# Altium schematic sheet PA stage 1.SchDoc
size A; SheetNumber: 8; SheetTotal: 12
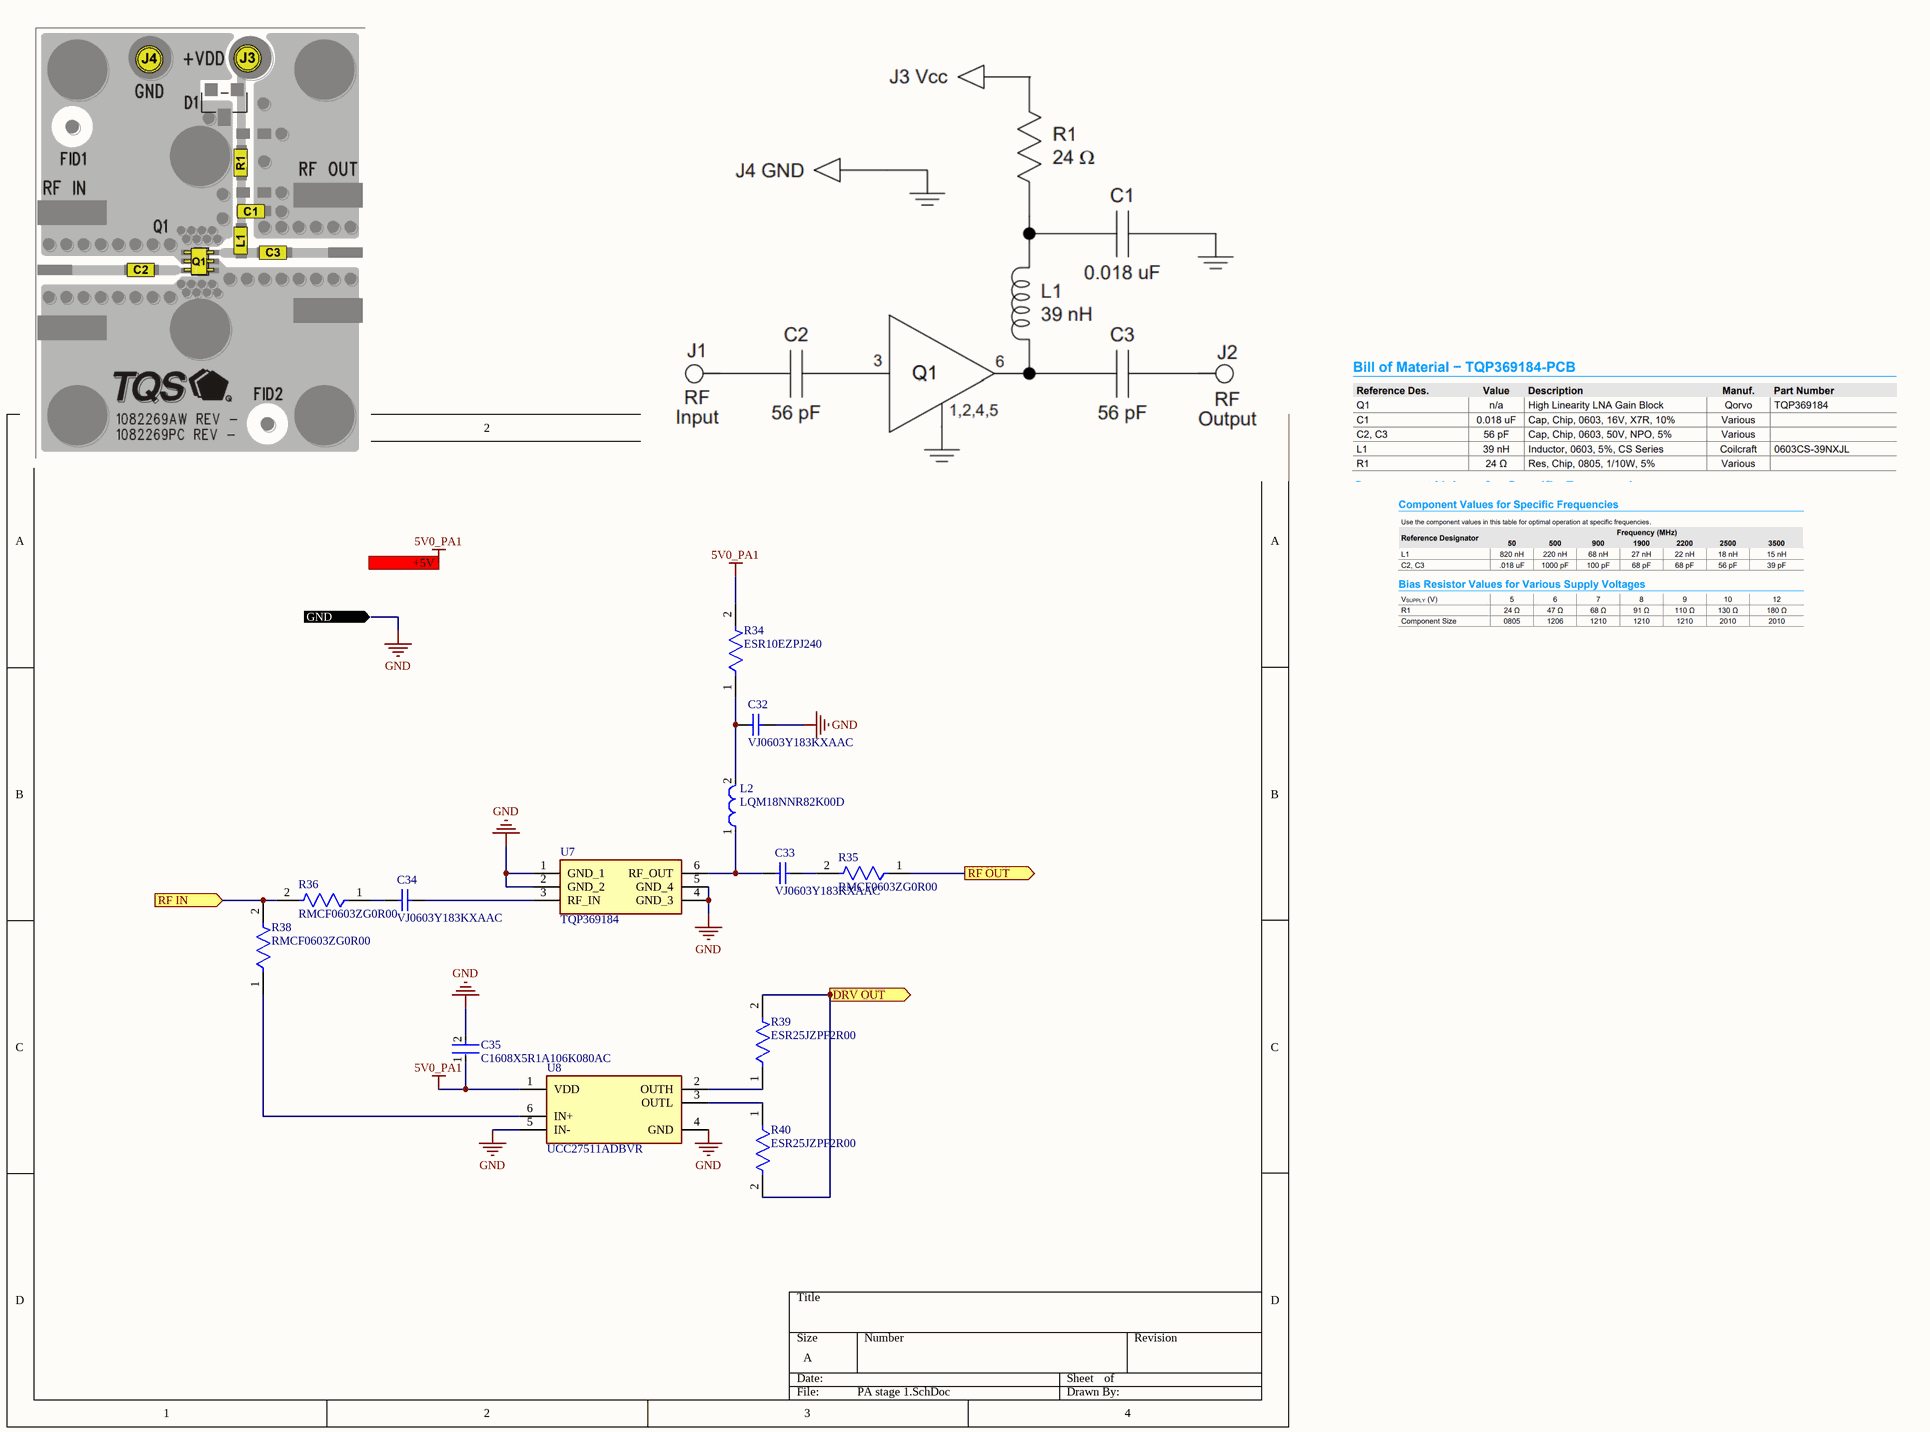
[diagram p0: PA stage 1.SchDoc]

## Parts
C32  VJ0603Y183KXAAC  [CAPC1608X92X38ML15T08]
C33  VJ0603Y183KXAAC  [CAPC1608X92X38ML15T08]
C34  VJ0603Y183KXAAC  [CAPC1608X92X38ML15T08]
C35  C1608X5R1A106K080AC  [FP-C1608-080-0_1-MFG]
L2  LQM18NNR82K00D  [FP-LQM18NN_00-IPC_B]
R34  ESR10EZPJ240  [FP-ESR10-IPC_C]
R35  RMCF0603ZG0R00  [FP-RMCF0603-IPC_B]
R36  RMCF0603ZG0R00  [FP-RMCF0603-IPC_B]
R38  RMCF0603ZG0R00  [FP-RMCF0603-IPC_B]
R39  ESR25JZPF2R00  [FP-ESR25-MFG]
R40  ESR25JZPF2R00  [FP-ESR25-MFG]
U7  TQP369184  [SOT65P210X110-6N]
U8  UCC27511ADBVR  [FP-DBV0006A-IPC_B]

## Ports
+5V (in), DRV OUT (out), GND (in), RF IN (in), RF OUT (out)

## Nets
5V0_PA1: C35.1 R34.2 U8.1(VDD) ; port +5V
GND: C32.2 C35.2 U7.1(GND_1) U7.2(GND_2) U7.4(GND_3) U7.5(GND_4) U8.4(GND) U8.5(IN-) ; port GND
DRV OUT: R39.2 R40.2 ; port DRV OUT
RF IN: R36.2 R38.2 ; port RF IN
RF OUT: R35.1 ; port RF OUT
NetC32_1: C32.1 L2.2 R34.1
NetC33_1: C33.1 L2.1 U7.6(RF_OUT)
NetC33_2: C33.2 R35.2
NetC34_1: C34.1 R36.1
NetC34_2: C34.2 U7.3(RF_IN)
NetR38_1: R38.1 U8.6(IN+)
NetR39_1: R39.1 U8.2(OUTH)
NetR40_1: R40.1 U8.3(OUTL)

## Library data of the parts
C32-C34 = CMP-2006-01326-1: Manufacturer: Vitramon; Part Number: VJ0603Y183KXAAC
C35 = CMP-2000-04979-3: Multilayer Ceramic Capacitors 10μF ±10% 10V X5R SMD 0603; Capacitance: 10uF; Dielectric Material: Ceramic; Construction: Flat; Height: 0.8mm; Thickness: 0.035inch; Case Code (Metric): 1608; Radiation Hardening: No; Number of Pins: 2; Voltage Rating (DC): 10V; Depth: 0.8mm; Voltage: 10V; RoHS Compliant: Yes; Voltage Rating: 10V; Package Quantity: 1; Resistor Type: Ceramic; Termination: SMD/SMT; Lead Free: Lead Free; REACH SVHC: No SVHC; Tolerance: 10%; Mount: Surface Mount; Series: C; Packaging: Tape and Reel; Width: 0.8mm; Dielectric: X5R; Weight: 7.1E-05oz; Length: 1.6mm; Max Operating Temperature: 85°C; Case Code (Imperial): 0603; Case/Package: 0603; Min Operating Temperature: -55°C
L2 = CMP-06042-016197-1: Multilayer Type Inductor for General Circuits, 0603 (1608), 820nH, 10%, 2.1Ω, 35mA; Self Resonant Frequency: 85MHz; Shielding: Shielded; DC Resistance (DCR): 2.1R; Test Frequency: 25MHz; Core Material: Ferrite; Q Factor: 15; RoHS Compliant: Yes; Length: 1.6mm; Max Operating Temperature: 85°C; Case Code (Metric): 1608; Lead Free: Lead Free; Package Quantity: 1; Series: LQM18N; Height - Seated (Max): 0.037inch; Current Rating: 35mA; Radiation Hardening: No; REACH SVHC: No SVHC; Termination: SMD/SMT; Case Code (Imperial): 0603; Width: 0.031inch; Height: 0.8mm; Tolerance: 10%; Military Standard: Not; Mount: Surface Mount; Max DC Current: 35mA; Depth: 0.95mm; Inductance: 820nH; Min Operating Temperature: -40°C; DC Current: 35mA; Case/Package: 0603; Packaging: Tape and Reel
R34 = CMP-08839-028611-1: 24Ω ±5% 0.4W 0805 Anti-Surge Chip Resistor AEC-Q200; Temperature Coefficient: 200ppm/°C; Resistance: 24R; Max Power Dissipation: 400mW; Tolerance: 5%; RoHS Compliant: Yes; Max Operating Temperature: 155°C; Min Operating Temperature: -55°C; Resistor Type: Thick Film; Width: 0.049inch; Length: 0.079inch; Number of Terminations: 2; Height: 0.026inch; Case Code (Imperial): 0805; Series: ESR; Case/Package: 0805; Case Code (Metric): 2012; Packaging: Tape and Reel; Features: Automotive AEC-Q200; Package Quantity: 1
R35 R36 R38 = CMP-26527-006412-1: 0Ω ±0 0.1W 0603 Thick Film Chip Resistor AEC-Q200 compliant; Max Power Dissipation: 100mW; Resistance: 0R; Width: 0.031inch; RoHS Compliant: Yes; Number of Terminations: 2; Case/Package: 0603; Contact Plating: Tin; Height: 0.022inch; Resistor Type: Thick Film; Mount: Surface Mount; Length: 0.061inch; Features: Automotive AEC-Q200; Series: RMCF; Max Operating Temperature: 155°C; Radiation Hardening: No; Min Operating Temperature: -55°C; Packaging: Tape and Reel
R39 R40 = CMP-08839-008954-1: 2Ω ±1% 0.66W 1210 Anti-Surge Chip Resistor AEC-Q200; Temperature Coefficient: 100ppm/°C; Resistance: 2R; Power Rating: 500mW; Series: ESR; RoHS Compliant: Yes; Number of Terminations: 2; Length: 0.126inch; Case/Package: 1210; Min Operating Temperature: -55°C; Width: 0.098inch; Lead Free: Lead Free; Packaging: Tape and Reel; Features: Automotive AEC-Q200; Height: 0.026inch; Case Code (Imperial): 1210; Case Code (Metric): 3225; Size Code: 1210; Package Quantity: 1; Max Operating Temperature: 155°C; Resistor Type: Thick Film; Max Power Dissipation: 500mW; Tolerance: 1%
U7 = TQP369184: DC  6 GHz Gain Block; Manufacturer_Name: Qorvo; Geometry.Height: 1.1mm; Mouser Part Number: 772-TQP369184; Mouser Price/Stock: https://www.mouser.co.uk/ProductDetail/Qorvo/TQP369184?qs=opBjA1TV900HByuIeJCWsQ%3D%3D; Manufacturer_Part_Number: TQP369184; Datasheet Link: https://www.qorvo.com/products/d/da005471
U8 = CMP-04912-000035-1: IC GATE DRVR LOW-SIDE SOT23-6; Number of Drivers: 1; Max Output Current: 8A; Channel Type: Single; Case/Package: SOT-23-6; Mount: Surface Mount; Max Operating Temperature: 140°C; Packaging: Tape and Reel; Min Operating Temperature: -40°C; RoHS Compliant: Yes; Number of Channels: 1